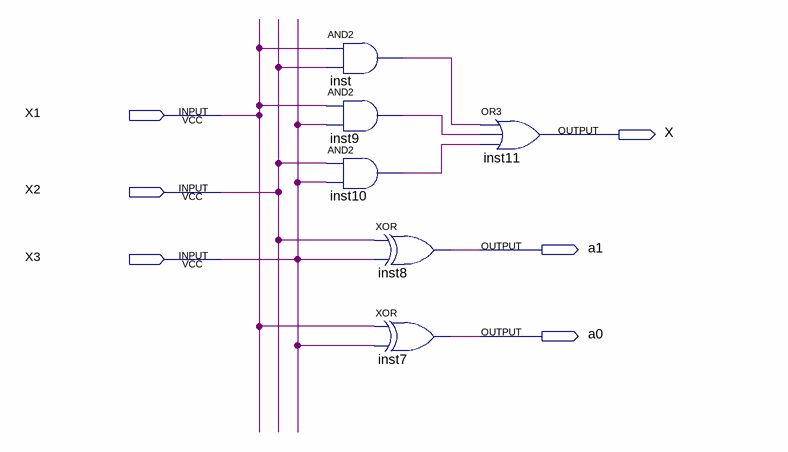
[diagram p0: schematic sheet]
// Quartus schematic major.bdf as structural Verilog: 6 symbols, 6 pins
module major (
  input  X1,
  input  X2,
  input  X3,
  output X,
  output a1,
  output a0
);

  wire inst9_out, inst10_out, inst_out;

  and inst (inst_out, X1, X2);
  and inst9 (inst9_out, X1, X3);
  and inst10 (inst10_out, X2, X3);
  xor inst8 (a1, X2, X3);
  xor inst7 (a0, X1, X3);
  or inst11 (X, inst_out, inst9_out, inst10_out);
endmodule
